# Altium project SHMP_MainBoard.PrjPcb
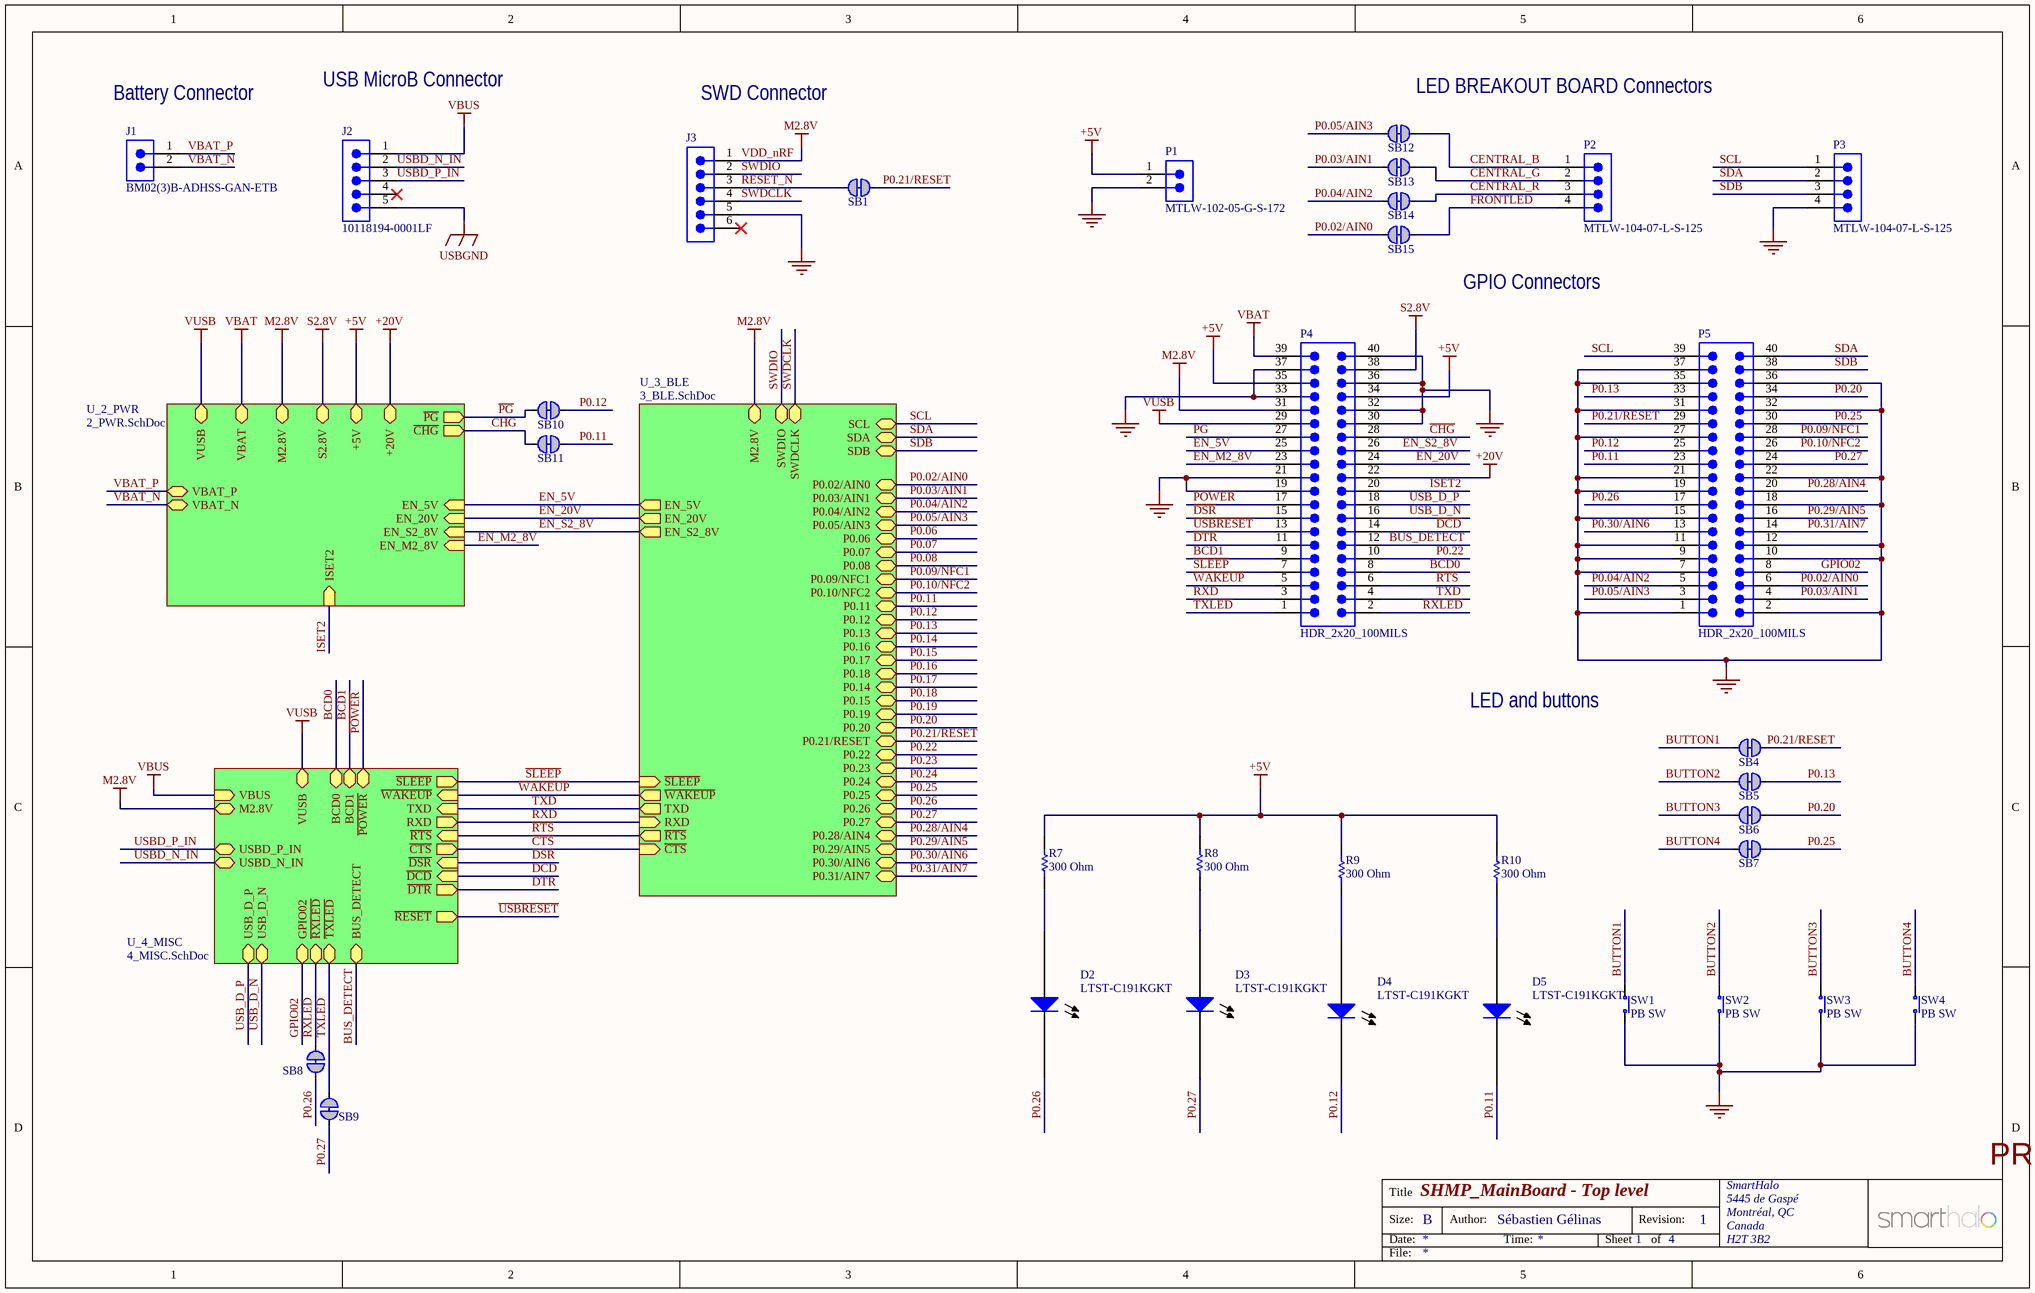
[diagram p0: 1_TOP.SchDoc]
ApprovedBy: Olivier Bourbonnais
4 sheets, 115 parts. Net scope: hierarchical (ports join the sheet entries above them; power ports are global).
Board file: SHMP_MainBoard.PcbDoc
Sheets:
  1_TOP.SchDoc
    U_3_BLE = 3_BLE.SchDoc
    U_2_PWR = 2_PWR.SchDoc
    U_4_MISC = 4_MISC.SchDoc

## Sheet 1_TOP.SchDoc: SHMP_MainBoard - Top level
size B; Author: Sébastien Gélinas; Organization: SmartHalo; Address1: 5445 de Gaspé; Address2: Montréal, QC; Address3: Canada; Address4: H2T 3B2; DocumentNumber: 1; Revision: 1; SheetNumber: 1; SheetTotal: 4

### Parts
D2  LTST-C191KGKT  [LTST-C191KGKT]
D3  LTST-C191KGKT  [LTST-C191KGKT]
D4  LTST-C191KGKT  [LTST-C191KGKT]
D5  LTST-C191KGKT  [LTST-C191KGKT]
J1  BM02(3)B-ADHSS-GAN-ETB  [BM02(3)B-ADHSS-GAN-ETB]
J2  10118194-0001LF  [10118194-0001LF]
J3  (no value)  [JLINK_6PIN_NEEDLE_ADAPTER]  (no BOM)
P1  MTLW-102-05-G-S-172  [SMTC-MTLW-102-05-X-S-172]  (no BOM)
P2  MTLW-104-07-L-S-125  [SMTC-MTLW-104-07-X-S-125]  (no BOM)
P3  MTLW-104-07-L-S-125  [SMTC-MTLW-104-07-X-S-125]  (no BOM)
P4  HDR_2x20_100MILS  [HDR_2X20_100MILS]  (no BOM)
P5  HDR_2x20_100MILS  [HDR_2X20_100MILS]  (no BOM)
R7  300 Ohm  [Varitron_RES0603]
R8  300 Ohm  [Varitron_RES0603]
R9  300 Ohm  [Varitron_RES0603]
R10  300 Ohm  [Varitron_RES0603]
SB1  Solderbridge  [Solderbridge_Shorted]  (value not drawn)  (net tie, no BOM)
SB4  Solderbridge  [Solderbridge_Shorted]  (value not drawn)  (net tie, no BOM)
SB5  Solderbridge  [Solderbridge_Shorted]  (value not drawn)  (net tie, no BOM)
SB6  Solderbridge  [Solderbridge_Shorted]  (value not drawn)  (net tie, no BOM)
SB7  Solderbridge  [Solderbridge_Shorted]  (value not drawn)  (net tie, no BOM)
SB8  Solderbridge  [Solderbridge_Shorted]  (value not drawn)  (net tie, no BOM)
SB9  Solderbridge  [Solderbridge_Shorted]  (value not drawn)  (net tie, no BOM)
SB10  Solderbridge  [Solderbridge_Shorted]  (value not drawn)  (net tie, no BOM)
SB11  Solderbridge  [Solderbridge_Shorted]  (value not drawn)  (net tie, no BOM)
SB12  Solderbridge  [Solderbridge_Shorted]  (value not drawn)  (net tie, no BOM)
SB13  Solderbridge  [Solderbridge_Shorted]  (value not drawn)  (net tie, no BOM)
SB14  Solderbridge  [Solderbridge_Shorted]  (value not drawn)  (net tie, no BOM)
SB15  Solderbridge  [Solderbridge_Shorted]  (value not drawn)  (net tie, no BOM)
SW1  PB SW  [ALPS_SKHUxxx010_WO_GND]
SW2  PB SW  [ALPS_SKHUxxx010_WO_GND]
SW3  PB SW  [ALPS_SKHUxxx010_WO_GND]
SW4  PB SW  [ALPS_SKHUxxx010_WO_GND]

### Sub-sheets
U_2_PWR = 2_PWR.SchDoc: ISET2 (in), ~{PG} (out), ~{CHG} (out), EN_S2_8V (in), EN_M2_8V (in), EN_20V (in), EN_5V (in), +20V, +5V, S2.8V, M2.8V, VUSB, VBAT_N, VBAT_P, VBAT
U_3_BLE = 3_BLE.SchDoc: SDA (bidir), SDB (bidir), SCL (bidir), ~{WAKEUP} (out), ~{SLEEP} (in), RXD (in), TXD (out), P0.02/AIN0, P0.03/AIN1, P0.04/AIN2, P0.05/AIN3, P0.06, P0.07, P0.08, P0.09/NFC1, P0.10/NFC2, P0.11, P0.12, P0.13, P0.16, P0.17, P0.18, P0.14, P0.15, P0.19, P0.20, P0.21/RESET, P0.22, P0.23, P0.24, P0.25, P0.26, P0.27, P0.28/AIN4, P0.29/AIN5, P0.30/AIN6, P0.31/AIN7, SWDIO (bidir), SWDCLK (bidir), EN_S2_8V (out), EN_5V (out), EN_20V (out), ~{CTS} (in), ~{RTS} (out), M2.8V
U_4_MISC = 4_MISC.SchDoc: TXD (in), RXD (out), ~{CTS} (out), ~{RTS} (in), ~{WAKEUP} (in), ~{RESET} (out), ~{DSR} (in), ~{DCD} (in), ~{DTR} (out), BCD0, BUS_DETECT, GPIO02, ~{POWER}, ~{TXLED}, BCD1, ~{RXLED}, VBUS (in), USBD_P_IN (bidir), USBD_N_IN (bidir), USB_D_N (bidir), USB_D_P (bidir), ~{SLEEP} (out), M2.8V, VUSB

### Nets
+5V: P1.1 P4.34 P4.35 R7.2 R8.2 R9.2 R10.2 ; sheet U_2_PWR/+5V
+20V: P4.22 ; sheet U_2_PWR/+20V
GND: J1.0(ASSY) J3.5 P1.2 P3.4 P4.19 P4.21 P4.30 P4.32 P4.33 P4.36 P4.37 P4.40 P5.1 P5.2 P5.7 P5.9 P5.10 P5.11 P5.12 P5.15 P5.18 P5.19 P5.21 P5.22 P5.27 P5.31 P5.32 P5.35 P5.36 P5.37 SW1.1(N.O) SW2.1(N.O) SW3.1(N.O) SW4.1(N.O)
S2.8V: P4.38 ; sheet U_2_PWR/S2.8V
USBGND: J2.0(ASSY) J2.5
VBAT: P4.39 ; sheet U_2_PWR/VBAT
VBUS: J2.1 ; sheet U_4_MISC/VBUS
VDD_nRF: J3.1 P4.31 ; sheet U_3_BLE/M2.8V, sheet U_2_PWR/M2.8V, sheet U_4_MISC/M2.8V  [also labelled M2.8V]
VUSB: P4.29 ; sheet U_2_PWR/VUSB, sheet U_4_MISC/VUSB
BCD0: P4.8 ; sheet U_4_MISC/BCD0
BCD1: P4.9 ; sheet U_4_MISC/BCD1
BUS_DETECT: P4.12 ; sheet U_4_MISC/BUS_DETECT
BUTTON1: SB4.2 SW1.2(COM)
BUTTON2: SB5.2 SW2.2(COM)
BUTTON3: SB6.2 SW3.2(COM)
BUTTON4: SB7.2 SW4.2(COM)
~{CHG}: P4.28 SB11.1 ; sheet U_2_PWR/~{CHG}
~{CTS}: P4.10 ; sheet U_3_BLE/P0.22, sheet U_3_BLE/~{CTS}, sheet U_4_MISC/~{CTS}  [also labelled P0.22]
CENTRAL_B: P2.1 SB12.1
CENTRAL_G: P2.2 SB13.1
CENTRAL_R: P2.3 SB14.1
~{DCD}: P4.14 ; sheet U_4_MISC/~{DCD}
~{DSR}: P4.15 ; sheet U_4_MISC/~{DSR}
~{DTR}: P4.11 ; sheet U_4_MISC/~{DTR}
EN_5V: P4.25 ; sheet U_3_BLE/P0.14, sheet U_3_BLE/EN_5V, sheet U_2_PWR/EN_5V  [also labelled P0.17]
EN_20V: P4.24 ; sheet U_3_BLE/P0.15, sheet U_3_BLE/EN_20V, sheet U_2_PWR/EN_20V  [also labelled P0.18]
EN_M2_8V: P4.23 ; sheet U_2_PWR/EN_M2_8V
EN_S2_8V: P4.26 ; sheet U_3_BLE/P0.16, sheet U_3_BLE/EN_S2_8V, sheet U_2_PWR/EN_S2_8V  [also labelled P0.14]
FRONTLED: P2.4 SB15.1
GPIO02: P5.8 ; sheet U_4_MISC/GPIO02
ISET2: P4.20 ; sheet U_2_PWR/ISET2
P0.02/AIN0: P5.6 SB15.2 ; sheet U_3_BLE/P0.02/AIN0
P0.03/AIN1: P5.4 SB13.2 ; sheet U_3_BLE/P0.03/AIN1
P0.04/AIN2: P5.5 SB14.2 ; sheet U_3_BLE/P0.04/AIN2
P0.05/AIN3: P5.3 SB12.2 ; sheet U_3_BLE/P0.05/AIN3
P0.06: P4.7 ; sheet U_3_BLE/~{SLEEP}, sheet U_3_BLE/P0.06, sheet U_4_MISC/~{SLEEP}  [also labelled ~{SLEEP}]
P0.07: P4.5 ; sheet U_3_BLE/~{WAKEUP}, sheet U_3_BLE/P0.07, sheet U_4_MISC/~{WAKEUP}  [also labelled ~{WAKEUP}]
P0.08: P4.6 ; sheet U_3_BLE/P0.08, sheet U_3_BLE/~{RTS}, sheet U_4_MISC/~{RTS}  [also labelled ~{RTS}]
P0.09/NFC1: P5.28 ; sheet U_3_BLE/P0.09/NFC1
P0.10/NFC2: P5.26 ; sheet U_3_BLE/P0.10/NFC2
P0.11: D5.2(Cathode) P5.23 SB11.2 ; sheet U_3_BLE/P0.11
P0.12: D4.2(Cathode) P5.25 SB10.2 ; sheet U_3_BLE/P0.12
P0.13: P5.33 SB5.1 ; sheet U_3_BLE/P0.13
P0.15: P3.1 P5.39 ; sheet U_3_BLE/SCL, sheet U_3_BLE/P0.17  [also labelled SCL]
P0.16: P3.2 P5.40 ; sheet U_3_BLE/SDA, sheet U_3_BLE/P0.18  [also labelled SDA]
P0.19: P3.3 P5.38 ; sheet U_3_BLE/SDB, sheet U_3_BLE/P0.19  [also labelled SDB]
P0.20: P5.34 SB6.1 ; sheet U_3_BLE/P0.20
P0.21/RESET: P5.29 SB1.1 SB4.1 ; sheet U_3_BLE/P0.21/RESET
P0.23: P4.4 ; sheet U_3_BLE/TXD, sheet U_3_BLE/P0.23, sheet U_4_MISC/TXD  [also labelled TXD]
P0.24: P4.3 ; sheet U_3_BLE/RXD, sheet U_3_BLE/P0.24, sheet U_4_MISC/RXD  [also labelled RXD]
P0.25: P5.30 SB7.1 ; sheet U_3_BLE/P0.25
P0.26: D2.2(Cathode) P5.17 SB8.2 ; sheet U_3_BLE/P0.26
P0.27: D3.2(Cathode) P5.24 SB9.2 ; sheet U_3_BLE/P0.27
P0.28/AIN4: P5.20 ; sheet U_3_BLE/P0.28/AIN4
P0.29/AIN5: P5.16 ; sheet U_3_BLE/P0.29/AIN5
P0.30/AIN6: P5.13 ; sheet U_3_BLE/P0.30/AIN6
P0.31/AIN7: P5.14 ; sheet U_3_BLE/P0.31/AIN7
~{PG}: P4.27 SB10.1 ; sheet U_2_PWR/~{PG}
~{POWER}: P4.17 ; sheet U_4_MISC/~{POWER}
~{RXLED}: P4.2 SB8.1 ; sheet U_4_MISC/~{RXLED}
RESET_N: J3.3 SB1.2
SWDCLK: J3.4 ; sheet U_3_BLE/SWDCLK
SWDIO: J3.2 ; sheet U_3_BLE/SWDIO
~{TXLED}: P4.1 SB9.1 ; sheet U_4_MISC/~{TXLED}
~{USBRESET}: P4.13 ; sheet U_4_MISC/~{RESET}  [project net ~{RESET}]
USB_D_N: P4.16 ; sheet U_4_MISC/USB_D_N
USB_D_P: P4.18 ; sheet U_4_MISC/USB_D_P
USBD_N_IN: J2.2 ; sheet U_4_MISC/USBD_N_IN
USBD_P_IN: J2.3 ; sheet U_4_MISC/USBD_P_IN
VBAT_N: J1.2 ; sheet U_2_PWR/VBAT_N
VBAT_P: J1.1 ; sheet U_2_PWR/VBAT_P
NetD2_1: D2.1(Anode) R7.1
NetD3_1: D3.1(Anode) R8.1
NetD4_1: D4.1(Anode) R9.1
NetD5_1: D5.1(Anode) R10.1

Not connected (* = marked no-connect by the designer): J2 4*; J3 6*

### Notes on the sheet
- (near J1) Battery Connector
- USB MicroB Connector
- SWD Connector
- (near SB12) LED BREAKOUT BOARD Connectors
- GPIO Connectors
- LED and buttons
- PRELIMINARY: DO NOT USE FOR PRODUCTION
- Title
- Size:
- Date:
- B
- Author:
- Time:
- Sheet
- Revision:
- of
- File:

### Library data of the parts
D2-D5 = LTST-C191KGKT: SMT LED, Green 571nm, Discrete 2V 0603 (1608 Metric); Manufacturer: LiteOn; Manufacturer Part Number: LTST-C191KGKT; Part Number: LTST-C191KGKT; Supplier: Digikey; Footprint Name: 0603; Supplier Part Number: 160-1446-6-ND
J1 = BM02(3)B-ADHSS-GAN-ETB: Connector, 1.3 mm pitch; Manufacturer: JST; Manufacturer Part Number: BM02(3)B-ADHSS-GAN-ETB; Part Number: BM02(3)B-ADHSS-GAN-ETB; Supplier: Arrow Electronics; Footprint Name: CUSTOM(ADH Connector 2 pins)
J2 = 10118194-0001LF: Micro USB B Type Receptacle; Manufacturer: Amphenol FCI; Manufacturer Part Number: 10118194-0001LF; Part Number: 10118194-0001LF; Supplier: Arrow Electronics; Footprint Name: CUSTOM(Micro USB connector); Supplier Part Number: *
J3 = JLINK_6PIN_NEEDLE_ADAPTER: JLink 6 Pin Needle Adapter for Flasher ARM Programmer; Manufacturer: JLink; Supplier: Digikey
P1 = SMTC-MTLW-102-05-X-S-172: Low Profile .025" SQ Post Header, Through-hole, Vertical, -55 to 125 degC, 2.54 mm Pitch, 2-Pin, Male, RoHS; Manufacturer: Samtec; Pitch: 2.54 mm; ComponentLink2URL: http://www.samtec.com/documents/webfiles/pdf/MTLW_TH.PDF; PackageDescription: Low Profile Terminal Assembly; ComponentLink3URL: http://www.samtec.com/documents/webfiles/cpdf/MTLW-1XX-XX-XX-X-XXX-XX-XX-MKT1.pdf; PackageReference: MTLW-102-05-X-S-172; Mounting Technology: Through-hole; ComponentLink2Description: Datasheet; PackageVersion: T, 6/1991; Orientation: Vertical; DatasheetVersion: F-214; RoHS: True; ComponentLink3Description: Package Specification; ComponentLink1URL: http://www.samtec.com; Temperature Range: -55 to 125 degC; PartNumber: MTLW-102-05-G-S-172; ComponentLink1Description: Manufacturer URL
P2 P3 = SMTC-MTLW-104-07-X-S-125: Low Profile .025" SQ Post Header, Through-hole, Vertical, -55 to 125 degC, 2.54 mm Pitch, 4-Pin, Male, RoHS; Manufacturer: Samtec; Pitch: 2.54 mm; PackageDescription: Low Profile Terminal Assembly; PartNumber: MTLW-104-07-L-S-125; PackageReference: MTLW-104-07-X-S-125; ComponentLink1Description: Manufacturer URL; ComponentLink2Description: Datasheet; ComponentLink2URL: http://www.samtec.com/documents/webfiles/pdf/MTLW_TH.PDF; ComponentLink3Description: Package Specification; Mounting Technology: Through-hole; ComponentLink3URL: http://www.samtec.com/documents/webfiles/cpdf/MTLW-1XX-XX-XX-X-XXX-XX-XX-MKT1.pdf; ComponentLink1URL: http://www.samtec.com; Orientation: Vertical; PackageVersion: T, 6/1991; DatasheetVersion: F-214; Temperature Range: -55 to 125 degC; RoHS: True
P4 P5 = HDR_2x20_100MILS: Header, 100 mils, 2 rows, 40 pins
R7-R10 = Varitron_RES0603: 300 0.063W 5%  0603 (1608 Metric)  SMD; Case-Metric: 1608; Case-EIA: 0603; Tolerance: 5%; Technology: SMT; Power: 0.063W; Supplier: Arrow Electronics; Footprint Name: 0603; Value: 300 Ohm
SB1 SB4-SB15 = SOLDERBRIDGE_SHORTED: Shorted Solderbridge; Value: Solderbridge
SW1-SW4 = SW-PB: ALPS - SKHUALE010 - Tactile Switch, SPNO, SMD, 6.5x6.2x2.5mm; Part Number: ALPS_SKHUALE010; 2nd source part number: 688-SKHUALE010; Artikkelnr Noca: 50019001; Artikkelnr Simpro: N.A.; Manufacturer: Alps; Manufacturer Part Number: SKHUALE010; Datasheet: https://www1.elfa.se/data1/wwwroot/webroot/Z_DATA/03579000.pdf; LatestRevisionDate: 2010-02-01; Pin Count: 4; Publisher: Nordic Semiconductor; Published: 2010-02-01; Value: PB SW; Note: *; Supplier: Elfa; Supplier part number: 35-790-00; 2nd source Supplier: Mouser; Footprint Doc: ALPS_SKHUxxx010_WO_GND

## Sheet 3_BLE.SchDoc: SHMP_MainBoard - Radio
size B; Author: Sébastien Gélinas; Organization: SmartHalo; Address1: 5445 de Gaspé; Address2: Montréal, QC; Address3: Canada; Address4: H2T 3B2; DocumentNumber: 4; Revision: 1; SheetNumber: 3; SheetTotal: 4
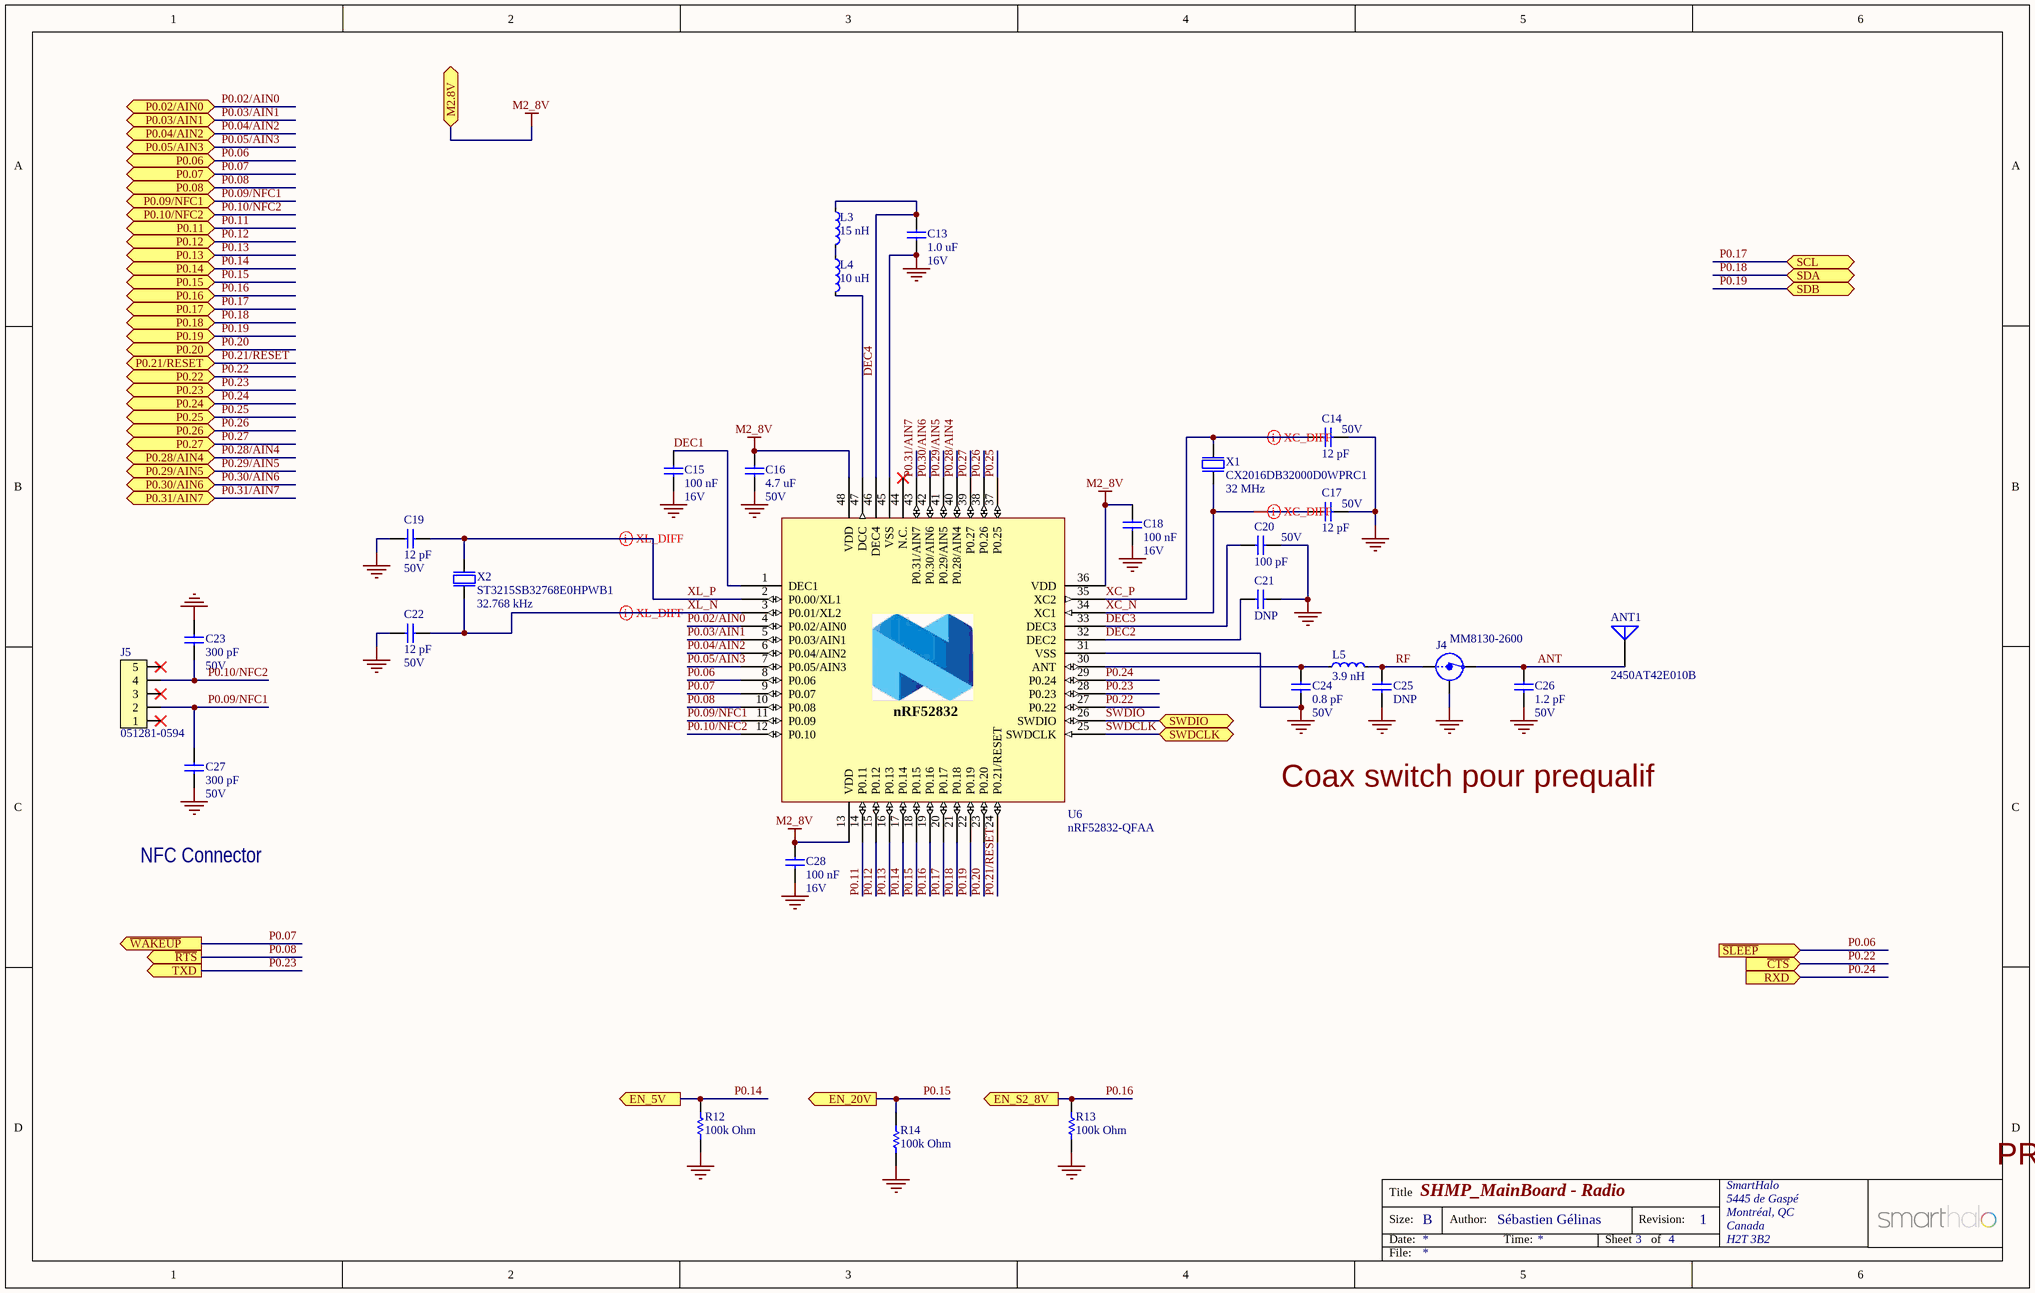
[diagram p1: 3_BLE.SchDoc]

### Parts
ANT1  2450AT42E010B  [2450AT42E010B]
C13  1.0 uF  Voltage Rating: 16V  [Varitron_CAP0603]
C14  12 pF  Voltage Rating: 50V  [Varitron_CAP0402]
C15  100 nF  Voltage Rating: 16V  [Varitron_CAP0402]
C16  4.7 uF  Voltage Rating: 50V  [Varitron_CAP0805]
C17  12 pF  Voltage Rating: 50V  [Varitron_CAP0402]
C18  100 nF  Voltage Rating: 16V  [Varitron_CAP0402]
C19  12 pF  Voltage Rating: 50V  [Varitron_CAP0402]
C20  100 pF  Voltage Rating: 50V  [Varitron_CAP0402]
C21  DNP  [Varitron_CAP0402]  (no BOM)
C22  12 pF  Voltage Rating: 50V  [Varitron_CAP0402]
C23  300 pF  Voltage Rating: 50V  [Varitron_CAP0402]
C24  0.8 pF  Voltage Rating: 50V  [Varitron_CAP0402]
C25  DNP  [Varitron_CAP0402]  (no BOM)
C26  1.2 pF  Voltage Rating: 50V  [Varitron_CAP0402]
C27  300 pF  Voltage Rating: 50V  [Varitron_CAP0402]
C28  100 nF  Voltage Rating: 16V  [Varitron_CAP0402]
J4  MM8130-2600  [COAXIAL-SWF]
J5  051281-0594  [Molex 051281-0594]
L3  15 nH  [Varitron_IND0402]
L4  10 uH  [Varitron_IND0603]
L5  3.9 nH  [Varitron_IND0402]
R12  100k Ohm  [Varitron_RES0402]
R13  100k Ohm  [Varitron_RES0402]
R14  100k Ohm  [Varitron_RES0402]
U6  nRF52832-QFAA  [QFN40P600X600X90-48N]
X1  CX2016DB32000D0WPRC1  Frequency: 32 MHz  [CRYSTAL_2016_4Pins]
X2  ST3215SB32768E0HPWB1  Frequency: 32.768 kHz  [CRYSTAL_3215_2Pins]

### Ports
EN_5V (out), EN_20V (out), EN_S2_8V (out), M2.8V, P0.02/AIN0, P0.03/AIN1, P0.04/AIN2, P0.05/AIN3, P0.06, P0.07, P0.08, P0.09/NFC1, P0.10/NFC2, P0.11, P0.12, P0.13, P0.14, P0.15, P0.16, P0.17, P0.18, P0.19, P0.20, P0.21/RESET, P0.22, P0.23, P0.24, P0.25, P0.26, P0.27, P0.28/AIN4, P0.29/AIN5, P0.30/AIN6, P0.31/AIN7, RXD (in), SCL (bidir), SDA (bidir), SDB (bidir), SWDCLK (bidir), SWDIO (bidir), TXD (out), ~{CTS} (in), ~{RTS} (out), ~{SLEEP} (in), ~{WAKEUP} (out)

### Nets
GND: ANT1.3(GND) ANT1.4(GND) C13.2 C14.2 C15.2 C16.2 C17.2 C18.2 C19.1 C20.2 C21.2 C22.1 C23.2 C24.1 C25.1 C26.1 C27.2 C28.2 J4.2(Shield) R12.1 R13.1 R14.2 U6.31(VSS) U6.45(VSS) U6.49(GND) X1.2(GND) X1.4(GND)
M2_8V: C16.1 C18.1 C28.1 U6.13(VDD) U6.36(VDD) U6.48(VDD) ; port M2.8V  [project net VDD_nRF]
ANT: ANT1.1(Feed) C26.2 J4.3(OUT)
DEC1: C15.1 U6.1(DEC1)
DEC2: C21.1 U6.32(DEC2)
DEC3: C20.1 U6.33(DEC3)
DEC4: C13.1 L3.1 U6.46(DEC4)
P0.02/AIN0: U6.4(P0.02/AIN0) ; port P0.02/AIN0
P0.03/AIN1: U6.5(P0.03/AIN1) ; port P0.03/AIN1
P0.04/AIN2: U6.6(P0.04/AIN2) ; port P0.04/AIN2
P0.05/AIN3: U6.7(P0.05/AIN3) ; port P0.05/AIN3
P0.06: U6.8(P0.06) ; port ~{SLEEP}, port P0.06
P0.07: U6.9(P0.07) ; port ~{WAKEUP}, port P0.07
P0.08: U6.10(P0.08) ; port ~{RTS}, port P0.08
P0.09/NFC1: C27.1 J5.2 U6.11(P0.09) ; port P0.09/NFC1
P0.10/NFC2: C23.1 J5.4 U6.12(P0.10) ; port P0.10/NFC2
P0.11: U6.14(P0.11) ; port P0.11
P0.12: U6.15(P0.12) ; port P0.12
P0.13: U6.16(P0.13) ; port P0.13
P0.14: R12.2 U6.17(P0.14) ; port EN_5V, port P0.14  [project net EN_5V]
P0.15: R14.1 U6.18(P0.15) ; port EN_20V, port P0.15  [project net EN_20V]
P0.16: R13.2 U6.19(P0.16) ; port EN_S2_8V, port P0.16  [project net EN_S2_8V]
P0.17: U6.20(P0.17) ; port SCL, port P0.17  [project net P0.15]
P0.18: U6.21(P0.18) ; port SDA, port P0.18  [project net P0.16]
P0.19: U6.22(P0.19) ; port SDB, port P0.19
P0.20: U6.23(P0.20) ; port P0.20
P0.21/RESET: U6.24(P0.21/RESET) ; port P0.21/RESET
P0.22: U6.27(P0.22) ; port ~{CTS}, port P0.22  [project net ~{CTS}]
P0.23: U6.28(P0.23) ; port TXD, port P0.23
P0.24: U6.29(P0.24) ; port RXD, port P0.24
P0.25: U6.37(P0.25) ; port P0.25
P0.26: U6.38(P0.26) ; port P0.26
P0.27: U6.39(P0.27) ; port P0.27
P0.28/AIN4: U6.40(P0.28/AIN4) ; port P0.28/AIN4
P0.29/AIN5: U6.41(P0.29/AIN5) ; port P0.29/AIN5
P0.30/AIN6: U6.42(P0.30/AIN6) ; port P0.30/AIN6
P0.31/AIN7: U6.43(P0.31/AIN7) ; port P0.31/AIN7
RF: C25.2 J4.1(IN) L5.2
SWDCLK: U6.25(SWDCLK) ; port SWDCLK
SWDIO: U6.26(SWDIO) ; port SWDIO
XC_N: C17.1 U6.34(XC1) X1.3(out)
XC_P: C14.1 U6.35(XC2) X1.1(inp)
XL_N: C22.2 U6.3(P0.01/XL2) X2.2
XL_P: C19.2 U6.2(P0.00/XL1) X2.1
NetC24_2: C24.2 L5.1 U6.30(ANT)
NetL3_2: L3.2 L4.1
NetL4_2: L4.2 U6.47(DCC)

Not connected (* = marked no-connect by the designer): ANT1 2(NC); J5 1* 3* 5*; U6 44(N.C.)*

### Layout directives
differential pair: XC_N, XC_P, XL_N, XL_P

### Notes on the sheet
- Coax switch pour prequalif
- NFC Connector
- PRELIMINARY: DO NOT USE FOR PRODUCTION
- Title
- Size:
- Date:
- B
- Author:
- Time:
- Sheet
- Revision:
- of
- File:
- (in symbol nRF52832_QFAA) nRF52832

### Library data of the parts
ANT1 = 2450AT42E010B: CHIP ANTENNA, 2.45GHz, 5 x 2 x 1.5 mm body; Manufacturer: Johanson Technology; Part Number: 2450AT42E010B; Manufacturer Part Number: 2450AT42E010B; Supplier: Arrow Electronics; Footprint Name: CUSTOM(2 pins)
C13 = Varitron_CAP0603: 1.0 uF 16V X7R 10% 0603 (1608 Metric)  SMD; Case-EIA: 0603; Case-Metric: 1608; Tolerance: 10%; Technology: SMT; Temperature Coefficient: X7R; Value: 1.0 uF; Supplier: Arrow Electronics; Footprint Name: 0603
C14 C17 C19 C22 = Varitron_CAP0402: 12 pF 50V NP0 2% 0402 (1005 Metric)  SMD; Case-EIA: 0402; Case-Metric: 1005; Tolerance: 2%; Technology: SMT; Temperature Coefficient: NP0; Value: 12 pF; Supplier: Arrow Electronics; Footprint Name: 0402
C15 C18 C28 = Varitron_CAP0402: 100 nF 16V X7R 10% 0402 (1005 Metric)  SMD; Case-EIA: 0402; Case-Metric: 1005; Tolerance: 10%; Technology: SMT; Temperature Coefficient: X7R; Value: 100 nF; Supplier: Arrow Electronics; Footprint Name: 0402
C16 = Varitron_CAP0805: 4.7 uF 50V X5R 10% 0805 (2012 Metric)  SMD; Case-EIA: 0805; Case-Metric: 2012; Tolerance: 10%; Technology: SMT; Temperature Coefficient: X5R; Value: 4.7 uF; Supplier: Arrow Electronics; Footprint Name: 0805
C20 = Varitron_CAP0402: 100 pF 50V NP0 5% 0402 (1005 Metric)  SMD; Case-EIA: 0402; Case-Metric: 1005; Tolerance: 5%; Technology: SMT; Temperature Coefficient: NP0; Value: 100 pF; Supplier: Arrow Electronics; Footprint Name: 0402
C21 C25 = Varitron_CAP0402: C nF V TEMP TOL% 0402 (1005 Metric)  SMD; Case-EIA: 0402; Case-Metric: 1005; Tolerance: TOL; Value: C nF; Technology: SMT; Supplier: Arrow Electronics; Footprint Name: 0402
C23 C27 = Varitron_CAP0402: 300 pF 50V NP0 5% 0402 (1005 Metric)  SMD; Case-EIA: 0402; Case-Metric: 1005; Tolerance: 5%; Technology: SMT; Temperature Coefficient: NP0; Value: 300 pF; Supplier: Arrow Electronics; Footprint Name: 0402
C24 = Varitron_CAP0402: 0.8 pF 50V NP0 5% 0402 (1005 Metric)  SMD; Case-EIA: 0402; Case-Metric: 1005; Tolerance: 5%; Technology: SMT; Temperature Coefficient: NP0; Value: 0.8 pF; Supplier: Arrow Electronics; Footprint Name: 0402
C26 = Varitron_CAP0402: 1.2 pF 50V NP0 ±0.1 pF 0402 (1005 Metric)  SMD; Case-EIA: 0402; Case-Metric: 1005; Tolerance: ±0.1 pF; Technology: SMT; Temperature Coefficient: NP0; Value: 1.2 pF; Supplier: Arrow Electronics; Footprint Name: 0402
J4 = Coaxial-Internal-SW: Coaxial Connector with Switch; Manufacturer: Murata; 2nd source part number: 81-MM8130-2600RA2; Artikkelnr Noca: 55029011; Artikkelnr Simpro: N.A.; Part Number: MM8130-2600; Manufacturer Part Number: MM8130-2600; Datasheet: http://www.murata.com/products/catalog/pdf/o33e.pdf; LatestRevisionDate: 2014-04-24; Pin Count: 3; Publisher: Nordic Semiconductor; Published: 2014-04-24; Note: *; Supplier: Digi-Key; Supplier part number: 490-4981-1-ND; 2nd source Supplier: Mouser; Footprint Doc: COAXIAL-SWF; Footprint Name: CUSTOM(6 pins)
J5 = Molex 051281-0594: CONN FFC FPC 5POS 0.50MM R/A; Manufacturer: Molex; Artikkelnr Noca: N.A.; Part Number: Molex 051281-0594; Manufacturer Part Number: 051281-0594; Datasheet: http://www.molex.com/pdm_docs/sd/512810694_sd.pdf; Footprint Doc: Molex 051281-0594; LatestRevisionDate: 2015-06-22; Pin Count: 7; Publisher: Nordic Semiconductor; Published: 2015-06-22; Value: Molex 051281-0594; Note: *; Supplier: Digi-Key; Supplier part number: WM9836CT-ND; 2nd source Supplier: *; 2nd source part number: *; Artikkelnr Simpro: N.A.; Footprint Name: CUSTOM(5 pins)
L3 = Varitron_IND0402: 15 nH 5%, 320 mA, 0402 (1005 Metric)  SMD; Manufacturer: Taiyo Yuden; Manufacturer Part Number: HK100515NJ-T; Case-EIA: 0402; Case-Metric: 1005; SRF: MHz; DCR: Ohm; Tolerance: 5%; Technology: SMT; Part Number: HK100515NJ-T; Value: 15 nH; Supplier: Arrow Electronics; Footprint Name: 0402
L4 = Varitron_IND0603: 10 uH 10%, 80 mA, 0603 (1608 Metric)  SMD; Manufacturer: Taiyo Yuden; Manufacturer Part Number: LBMF1608T100K; Case-EIA: 0603; Case-Metric: 1608; SRF: MHz; DCR: Ohm; Tolerance: 10%; Technology: SMT; Part Number: LBMF1608T100K; Value: 10 uH; Supplier: Arrow Electronics; Footprint Name: 0603
L5 = Varitron_IND0402: 3.9 nH ±0.1 nH 0402 (1005 Metric)  SMD; Manufacturer: Murata; Manufacturer Part Number: LQP15MN3N9B02D; Case-EIA: 0402; Case-Metric: 1005; Tolerance: ±0.1 nH; SRF: MHz; DCR: Ohm; Technology: SMT; Part Number: LQP15MN3N9B02D; Value: 3.9 nH; Supplier: Arrow Electronics; Footprint Name: 0402
R12-R14 = Varitron_RES0402: 100k 0.063W 5%  0402 (1005 Metric)  SMD; Case-Metric: 1005; Case-EIA: 0402; Tolerance: 5%; Technology: SMT; Power: 0.063W; Value: 100k Ohm; Supplier: Arrow Electronics; Footprint Name: 0402
U6 = nRF52832_QFAA: Multi-protocol Bluetooth Low Energy and 2.4GHz proprietary system-on-chip; Manufacturer: Nordic Semiconductor; Artikkelnr Noca: N.A.; Part Number: nRF52832-QFAA; Manufacturer Part Number: nRF52832-QFAA; Datasheet: *; LatestRevisionDate: 2014-11-26; Pin Count: 48; Publisher: Nordic Semiconductor; Published: 2014-11-26; Note: *; Supplier: Arrow Electronics; Supplier part number: *; 2nd source Supplier: *; 2nd source part number: *; Footprint Doc: QFN-48; Artikkelnr Simpro: N.A.; Footprint Name: QFN48TP
X1 = CX2016DB32000D0WPRC1: XTAL 32 MHz, 8pF, 3.2 x 1.5 mm, ±20 ppm Tol, ±200 ppm Drift; Manufacturer: AVX/Kyocera; Frequency Drift: ±40 ppm; Manufacturer Part Number: CX2016DB32000D0WPRC1; Part Number: CX2016DB32000D0WPRC1; Frequency Tolerance: ±40 ppm; Load Capacitance: 8 pF; Supplier: Arrow Electronics; Footprint Name: XTAL2016
X2 = ST3215SB32768E0HPWB1: XTAL 32.768 kHz, 9pF, 3.2 x 1.5 mm, ±20 ppm Tol, ±200 ppm Drift; Manufacturer: AVX/Kyocera; Frequency Tolerance: ±20 ppm; Frequency Drift: ±200 ppm; Manufacturer Part Number: ST3215SB32768E0HPWB1; Part Number: ST3215SB32768E0HPWB1; Load Capacitance: 9 pF; Supplier: Arrow Electronics; Footprint Name: XTAL3215

## Sheet 2_PWR.SchDoc: SHMP_MainBoard - Power Supply
size B; Author: Sébastien Gélinas; Organization: SmartHalo; Address1: 5445 de Gaspé; Address2: Montréal, QC; Address3: Canada; Address4: H2T 3B2; DocumentNumber: 1; Revision: 1; SheetNumber: 2; SheetTotal: 4
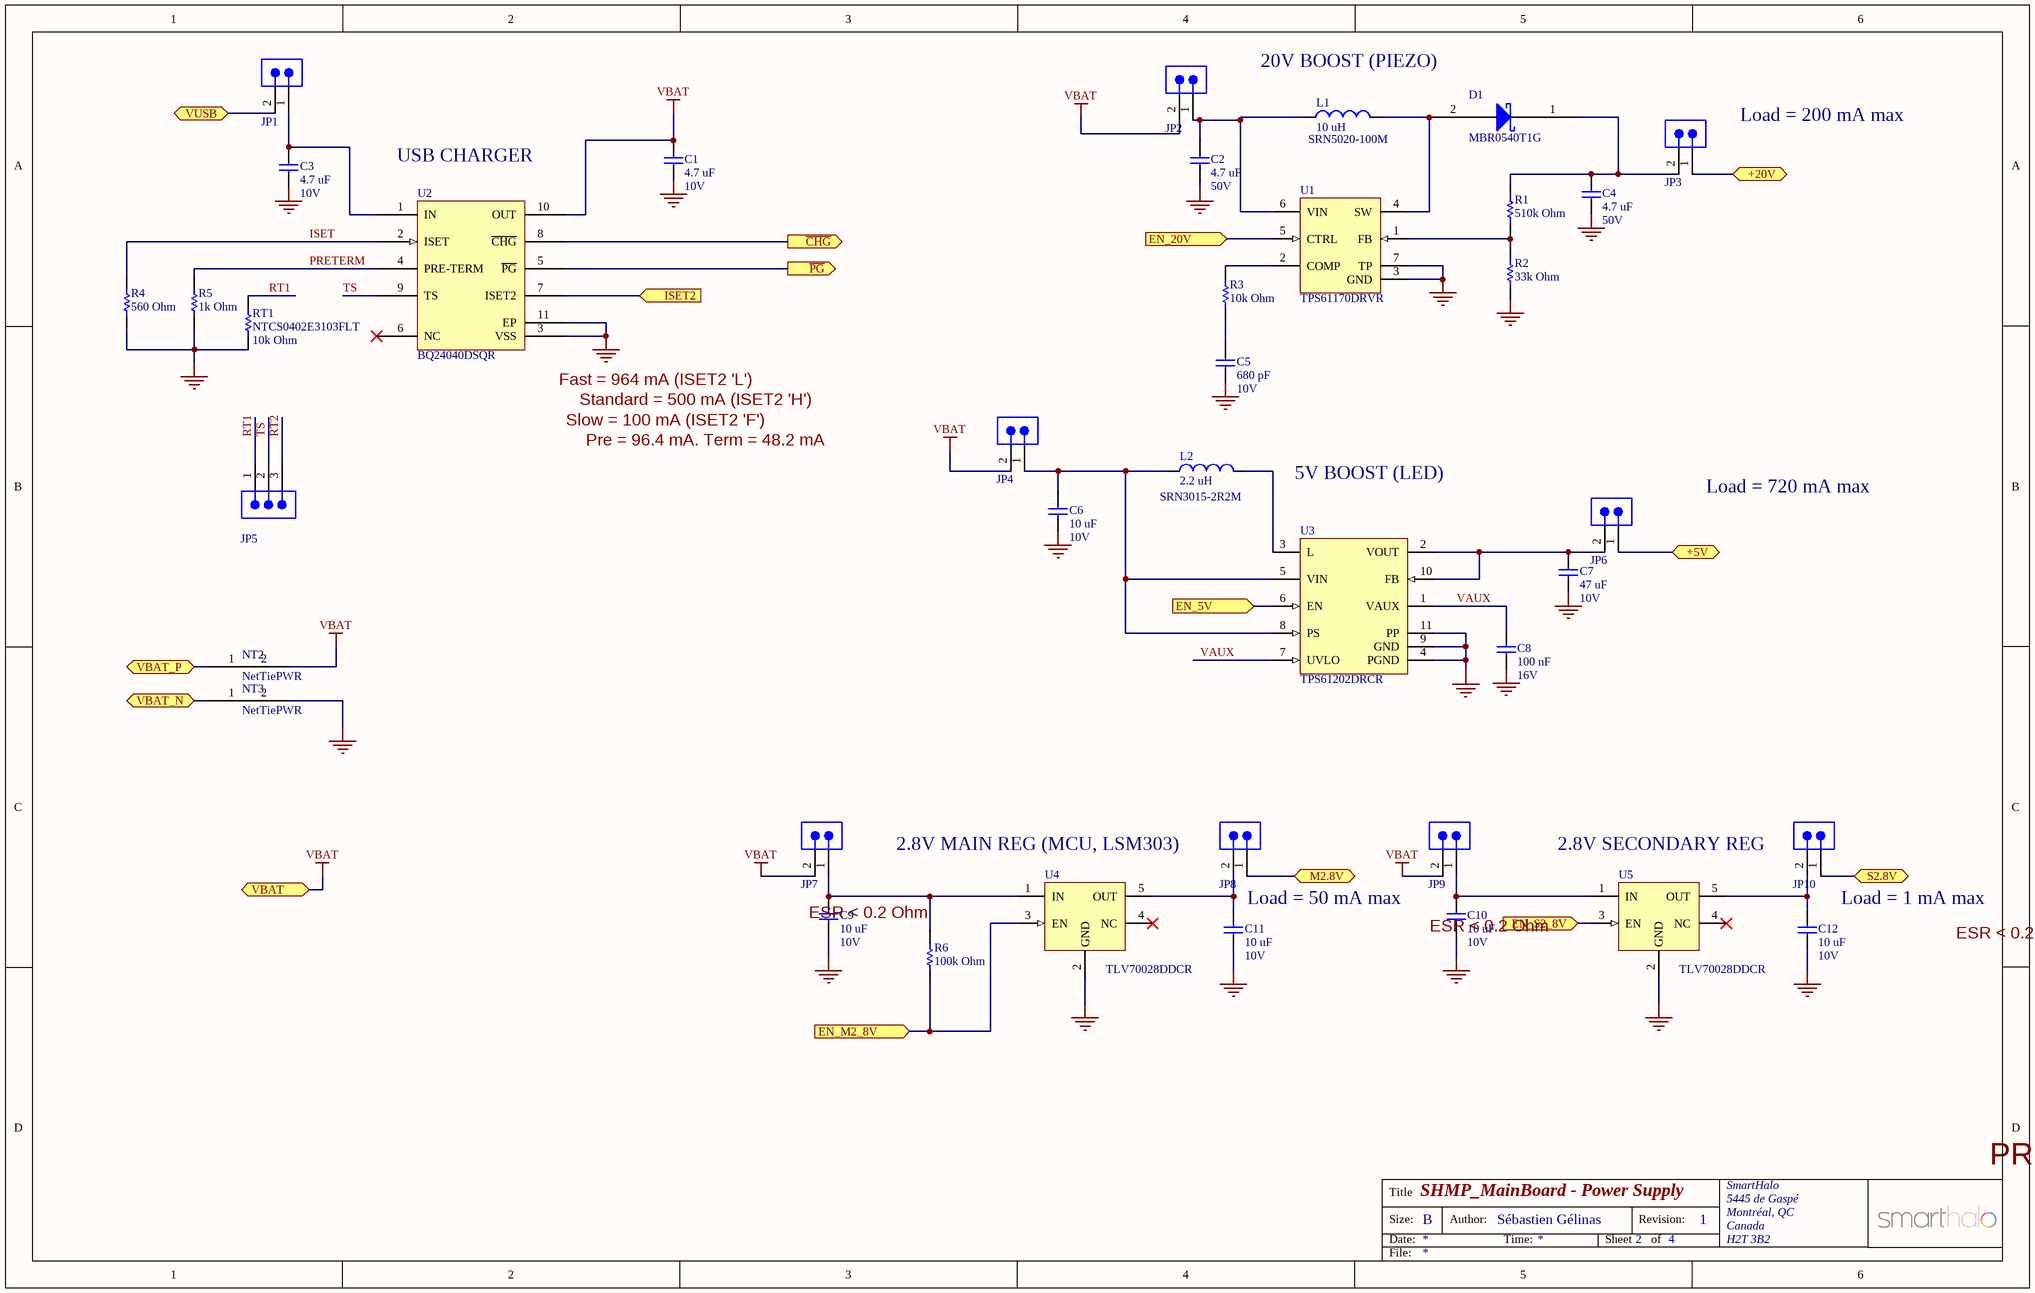
[diagram p2: 2_PWR.SchDoc]

### Parts
C1  4.7 uF  Voltage Rating: 10V  [Varitron_CAP0603]
C2  4.7 uF  Voltage Rating: 50V  [Varitron_CAP0805]
C3  4.7 uF  Voltage Rating: 10V  [Varitron_CAP0603]
C4  4.7 uF  Voltage Rating: 50V  [Varitron_CAP0805]
C5  680 pF  Voltage Rating: 10V  [Varitron_CAP0402]
C6  10 uF  Voltage Rating: 10V  [Varitron_CAP0805]
C7  47 uF  Voltage Rating: 10V  [Varitron_CAP1206]
C8  100 nF  Voltage Rating: 16V  [Varitron_CAP0402]
C9  10 uF  Voltage Rating: 10V  [Varitron_CAP0805]
C10  10 uF  Voltage Rating: 10V  [Varitron_CAP0805]
C11  10 uF  Voltage Rating: 10V  [Varitron_CAP0805]
C12  10 uF  Voltage Rating: 10V  [Varitron_CAP0805]
D1  MBR0540T1G  [ONSC-SOD-123-2-425-04_V]
JP1  JMP_2PINS_100MILS  [HDR_2X1_100MILS]  (value not drawn)  (no BOM)
JP2  JMP_2PINS_100MILS  [HDR_2X1_100MILS]  (value not drawn)  (no BOM)
JP3  JMP_2PINS_100MILS  [HDR_2X1_100MILS]  (value not drawn)  (no BOM)
JP4  JMP_2PINS_100MILS  [HDR_2X1_100MILS]  (value not drawn)  (no BOM)
JP5  JMP_3PINS_100MILS  [HDR_1X3_100MILS]  (value not drawn)  (no BOM)
JP6  JMP_2PINS_100MILS  [HDR_2X1_100MILS]  (value not drawn)  (no BOM)
JP7  JMP_2PINS_100MILS  [HDR_2X1_100MILS]  (value not drawn)  (no BOM)
JP8  JMP_2PINS_100MILS  [HDR_2X1_100MILS]  (value not drawn)  (no BOM)
JP9  JMP_2PINS_100MILS  [HDR_2X1_100MILS]  (value not drawn)  (no BOM)
JP10  JMP_2PINS_100MILS  [HDR_2X1_100MILS]  (value not drawn)  (no BOM)
L1  10 uH  [SRN5020-100M]
L2  2.2 uH  [SRN3015-2R2M]
NT2  NetTiePWR  [NetTiePWR]  (net tie, no BOM)
NT3  NetTiePWR  [NetTiePWR]  (net tie, no BOM)
R1  510k Ohm  [Varitron_RES0402]
R2  33k Ohm  [Varitron_RES0402]
R3  10k Ohm  [Varitron_RES0402]
R4  560 Ohm  [Varitron_RES0402]
R5  1k Ohm  [Varitron_RES0402]
R6  100k Ohm  [Varitron_RES0402]
RT1  NTCS0402E3103FLT  value 10k Ohm  [Varitron_RES0402]
U1  TPS61170DRVR  [DRV6-1600X1000TP]
U2  BQ24040DSQR  [DSQ10-1500X900TP]
U3  TPS61202DRCR  [DRC10-2400X1650TP]
U4  TLV70028DDCR  [SOT23-5_N]
U5  TLV70028DDCR  [SOT23-5_N]

### Ports
+5V, +20V, EN_5V (in), EN_20V (in), EN_M2_8V (in), EN_S2_8V (in), ISET2 (in), M2.8V, S2.8V, VBAT, VBAT_N, VBAT_P, VUSB, ~{CHG} (out), ~{PG} (out)

### Nets
+5V: JP6.1 ; port +5V
+20V: JP3.1 ; port +20V
GND: C1.2 C2.2 C3.2 C4.2 C5.2 C6.2 C7.2 C8.2 C9.2 C10.2 C11.2 C12.2 NT3.2(NET2) R2.1 R4.2 R5.2 RT1.1 U1.3(GND) U1.7(TP) U2.3(VSS) U2.11(EP) U3.4(PGND) U3.9(GND) U3.11(PP) U4.2(GND) U5.2(GND)
S2.8V: JP10.1 ; port S2.8V
VBAT: C1.1 JP2.2 JP4.2 JP7.2 JP9.2 NT2.2(NET2) U2.10(OUT) ; port VBAT
VDD_nRF: JP8.1 ; port M2.8V
VUSB: JP1.2 ; port VUSB
~{CHG}: U2.8(~{CHG}) ; port ~{CHG}
EN_5V: U3.6(EN) ; port EN_5V
EN_20V: U1.5(CTRL) ; port EN_20V
EN_M2_8V: R6.1 U4.3(EN) ; port EN_M2_8V
EN_S2_8V: U5.3(EN) ; port EN_S2_8V
ISET: R4.1 U2.2(ISET)
ISET2: U2.7(ISET2) ; port ISET2
~{PG}: U2.5(~{PG}) ; port ~{PG}
PRETERM: R5.1 U2.4(PRE-TERM)
RT1: JP5.1 RT1.2
RT2: JP5.3
TS: JP5.2 U2.9(TS)
VAUX: C8.1 U3.1(VAUX) U3.7(UVLO)
VBAT_N: NT3.1(NET1) ; port VBAT_N
VBAT_P: NT2.1(NET1) ; port VBAT_P
NetC2_1: C2.1 JP2.1 L1.1 U1.6(VIN)
NetC3_1: C3.1 JP1.1 U2.1(IN)
NetC4_1: C4.1 D1.1(Cathode) JP3.2 R1.2
NetC5_1: C5.1 R3.2
NetC6_1: C6.1 JP4.1 L2.1 U3.5(VIN) U3.8(PS)
NetC7_1: C7.1 JP6.2 U3.2(VOUT) U3.10(FB)
NetC9_1: C9.1 JP7.1 R6.2 U4.1(IN)
NetC10_1: C10.1 JP9.1 U5.1(IN)
NetC11_1: C11.1 JP8.2 U4.5(OUT)
NetC12_1: C12.1 JP10.2 U5.5(OUT)
NetD1_2: D1.2(Anode) L1.2 U1.4(SW)
NetL2_2: L2.2 U3.3(L)
NetR1_1: R1.1 R2.2 U1.1(FB)
NetR3_1: R3.1 U1.2(COMP)

Not connected (* = marked no-connect by the designer): U2 6(NC)*; U4 4(NC)*; U5 4(NC)*

### Notes on the sheet
- 20V BOOST (PIEZO)
- (near U2) USB CHARGER
- (near JP3) Load = 200 mA max
- (near U2) Fast = 964 mA (ISET2 'L')
- Slow = 100 mA (ISET2 'F')
- Standard = 500 mA (ISET2 'H')
- Pre = 96.4 mA. Term = 48.2 mA
- 5V BOOST (LED)
- Load = 720 mA max
- (near U4) 2.8V MAIN REG (MCU, LSM303)
- (near C11) Load = 50 mA max
- (near U5) 2.8V SECONDARY REG
- Load = 1 mA max
- (near C9) ESR < 0.2 Ohm
- (near C10) ESR < 0.2 Ohm
- (near C12) ESR < 0.2 Ohm
- PRELIMINARY: DO NOT USE FOR PRODUCTION
- Title
- Size:
- Date:
- B
- Author:
- Time:
- Sheet
- Revision:
- of
- File:

### Library data of the parts
C1 C3 = Varitron_CAP0603: 4.7 uF 10V X7R 10% 0603 (1608 Metric)  SMD; Case-EIA: 0603; Case-Metric: 1608; Tolerance: 10%; Technology: SMT; Temperature Coefficient: X7R; Value: 4.7 uF; Supplier: Arrow Electronics; Footprint Name: 0603
C2 C4 = Varitron_CAP0805: as C16 on sheet 3_BLE; Tolerance: 10%; Technology: SMT; Temperature Coefficient: X5R; Value: 4.7 uF; Supplier: Arrow Electronics; Footprint Name: 0805
C5 = Varitron_CAP0402: 680 pF 10V X7R 10% 0402 (1005 Metric)  SMD; Case-EIA: 0402; Case-Metric: 1005; Tolerance: 10%; Technology: SMT; Temperature Coefficient: X7R; Value: 680 pF; Supplier: Arrow Electronics; Footprint Name: 0402
C6 C9-C12 = Varitron_CAP0805: 10 uF 10V X7R 10% 0805 (2012 Metric)  SMD; Case-EIA: 0805; Case-Metric: 2012; Tolerance: 10%; Technology: SMT; Temperature Coefficient: X7R; Value: 10 uF; Supplier: Arrow Electronics; Footprint Name: 0805
C7 = Varitron_CAP1206: 47 uF 10V X5R 10% 1206 (3216 Metric)  SMD; Case-EIA: 1206; Case-Metric: 3216; Tolerance: 10%; Technology: SMT; Temperature Coefficient: X5R; Value: 47 uF; Supplier: Arrow Electronics; Footprint Name: 1206
C8 = Varitron_CAP0402: as C15 on sheet 3_BLE; Tolerance: 10%; Technology: SMT; Temperature Coefficient: X7R; Value: 100 nF; Supplier: Arrow Electronics; Footprint Name: 0402
D1 = MBR0540T1G: Schottky Power Rectifier, 2-Pin SOD-123, Pb-Free, Tape and Reel; Manufacturer: ON Semiconductor; Manufacturer Part Number: MBR0540T1G; Part Number: MBR0540T1G; Supplier: Arrow Electronics; Footprint Name: SOD123
JP1-JP4 JP6-JP10 = JMP_2PINS_100MILS: Jumper, 100 mils, 2 pins
JP5 = JMP_3PINS_100MILS: Jumper, 100 mils, 3 pins
L1 = SRN5020-100M: Inductor, 10 uH, 20%, 144 mOhm DCR, 1.3A; Manufacturer: Bourns; Manufacturer Part Number: SRN5020-100M; Part Number: SRN5020-100M; Value: 10 uH; Tolerance: 20%; DCR: 144 mOhm; Saturation Current: 1.3A; Supplier: Arrow Electronics; Footprint Name: IND5020
L2 = SRN3015-2R2M: Inductor, 2.2 uH, 20%, 72 mOhm DCR, 1.65A; Manufacturer: Bourns; DCR: 72 mOhm; Manufacturer Part Number: SRN3015-2R2M; Part Number: SRN3015-2R2M; Value: 2.2 uH; Tolerance: 20%; Saturation Current: 1.65A; Supplier: Arrow Electronics; Footprint Name: IND3015
R1 = Varitron_RES0402: 510k 0.063W 5%  0402 (1005 Metric)  SMD; Case-Metric: 1005; Case-EIA: 0402; Tolerance: 5%; Technology: SMT; Power: 0.063W; Value: 510k Ohm; Supplier: Arrow Electronics; Footprint Name: 0402
R2 = Varitron_RES0402: 33k 0.063W 5%  0402 (1005 Metric)  SMD; Case-Metric: 1005; Case-EIA: 0402; Tolerance: 5%; Technology: SMT; Power: 0.063W; Value: 33k Ohm; Supplier: Arrow Electronics; Footprint Name: 0402
R3 = Varitron_RES0402: 10k 0.063W 5%  0402 (1005 Metric)  SMD; Case-Metric: 1005; Case-EIA: 0402; Tolerance: 5%; Technology: SMT; Power: 0.063W; Value: 10k Ohm; Supplier: Arrow Electronics; Footprint Name: 0402
R4 = Varitron_RES0402: 560R 0.063W 5%  0402 (1005 Metric)  SMD; Case-Metric: 1005; Case-EIA: 0402; Tolerance: 5%; Technology: SMT; Power: 0.063W; Value: 560 Ohm; Supplier: Arrow Electronics; Footprint Name: 0402
R5 = Varitron_RES0402: 1k 0.063W 5%  0402 (1005 Metric)  SMD; Case-Metric: 1005; Case-EIA: 0402; Tolerance: 5%; Technology: SMT; Power: 0.063W; Value: 1k Ohm; Supplier: Arrow Electronics; Footprint Name: 0402
R6 = Varitron_RES0402: as R12 on sheet 3_BLE; Tolerance: 5%; Technology: SMT; Power: 0.063W; Supplier: Arrow Electronics; Footprint Name: 0402; Value: 100k Ohm
RT1 = NTCS0402E3103FLT: Thermistor NTC 0402, R0 10k, 1%, B 3490, SMD; Manufacturer: Vishay; Case-Metric: 1005; Case-EIA: 0402; Beta: 3490; Tolerance: 1%; Technology: SMT; Part Number: NTCS0402E3103FLT; Manufacturer Part Number: NTCS0402E3103FLT; Supplier: Arrow Electronics; Footprint Name: 0402
U1 = TPS61170DRVR: Boost Voltage Converter with 3 to 18 V Input and 3 to 38 V Output, -40 to 85 degC, 6-Pin SON (DRC), Green (RoHS & no Sb/Br); Manufacturer: Texas Instruments; Part Number: TPS61170DRVR; Manufacturer Part Number: TPS61170DRVR; Supplier: Arrow Electronics; Footprint Name: SON6
U2 = BQ24040DSQR: 800 mA, Single-Input, Single Cell Li-Ion Battery Charger with Auto Start. Vovp=6.6 V, 3.5 V, -40 to 85 degC, 10-pin SON (DSQ), Green (RoHS & no Sb/Br); Manufacturer: Texas Instruments; Manufacturer Part Number: BQ24040DSQR; Part Number: BQ24040DSQR; Supplier: Arrow Electronics; Footprint Name: WSON10
U3 = TPS61202DRCR: Boost Voltage Converter with 0.3 to 5.5 V Input and 5 V Output, -40 to 85 degC, 10-Pin SON (DRC), Green (RoHS & no Sb/Br); Manufacturer: Texas Instruments; Part Number: TPS61202DRCR; Manufacturer Part Number: TPS61202DRCR; Supplier: Arrow Electronics; Footprint Name: SON10
U4 U5 = TLV70028DDCR: 200 mA Low Dropout Regulator, 2 - 5.5V Input, Fixed 2.8V Output; Manufacturer: Texas Instruments; Part Number: TLV70028DDCR; Manufacturer Part Number: TLV70028DDCR; Supplier: Arrow Electronics; Footprint Name: SOT23-5

## Sheet 4_MISC.SchDoc: SHMP_MainBoard - Misc
size B; Author: Sébastien Gélinas; Organization: SmartHalo; Address1: 5445 de Gaspé; Address2: Montréal, QC; Address3: Canada; Address4: H2T 3B2; Revision: 1; SheetNumber: 4; SheetTotal: 4
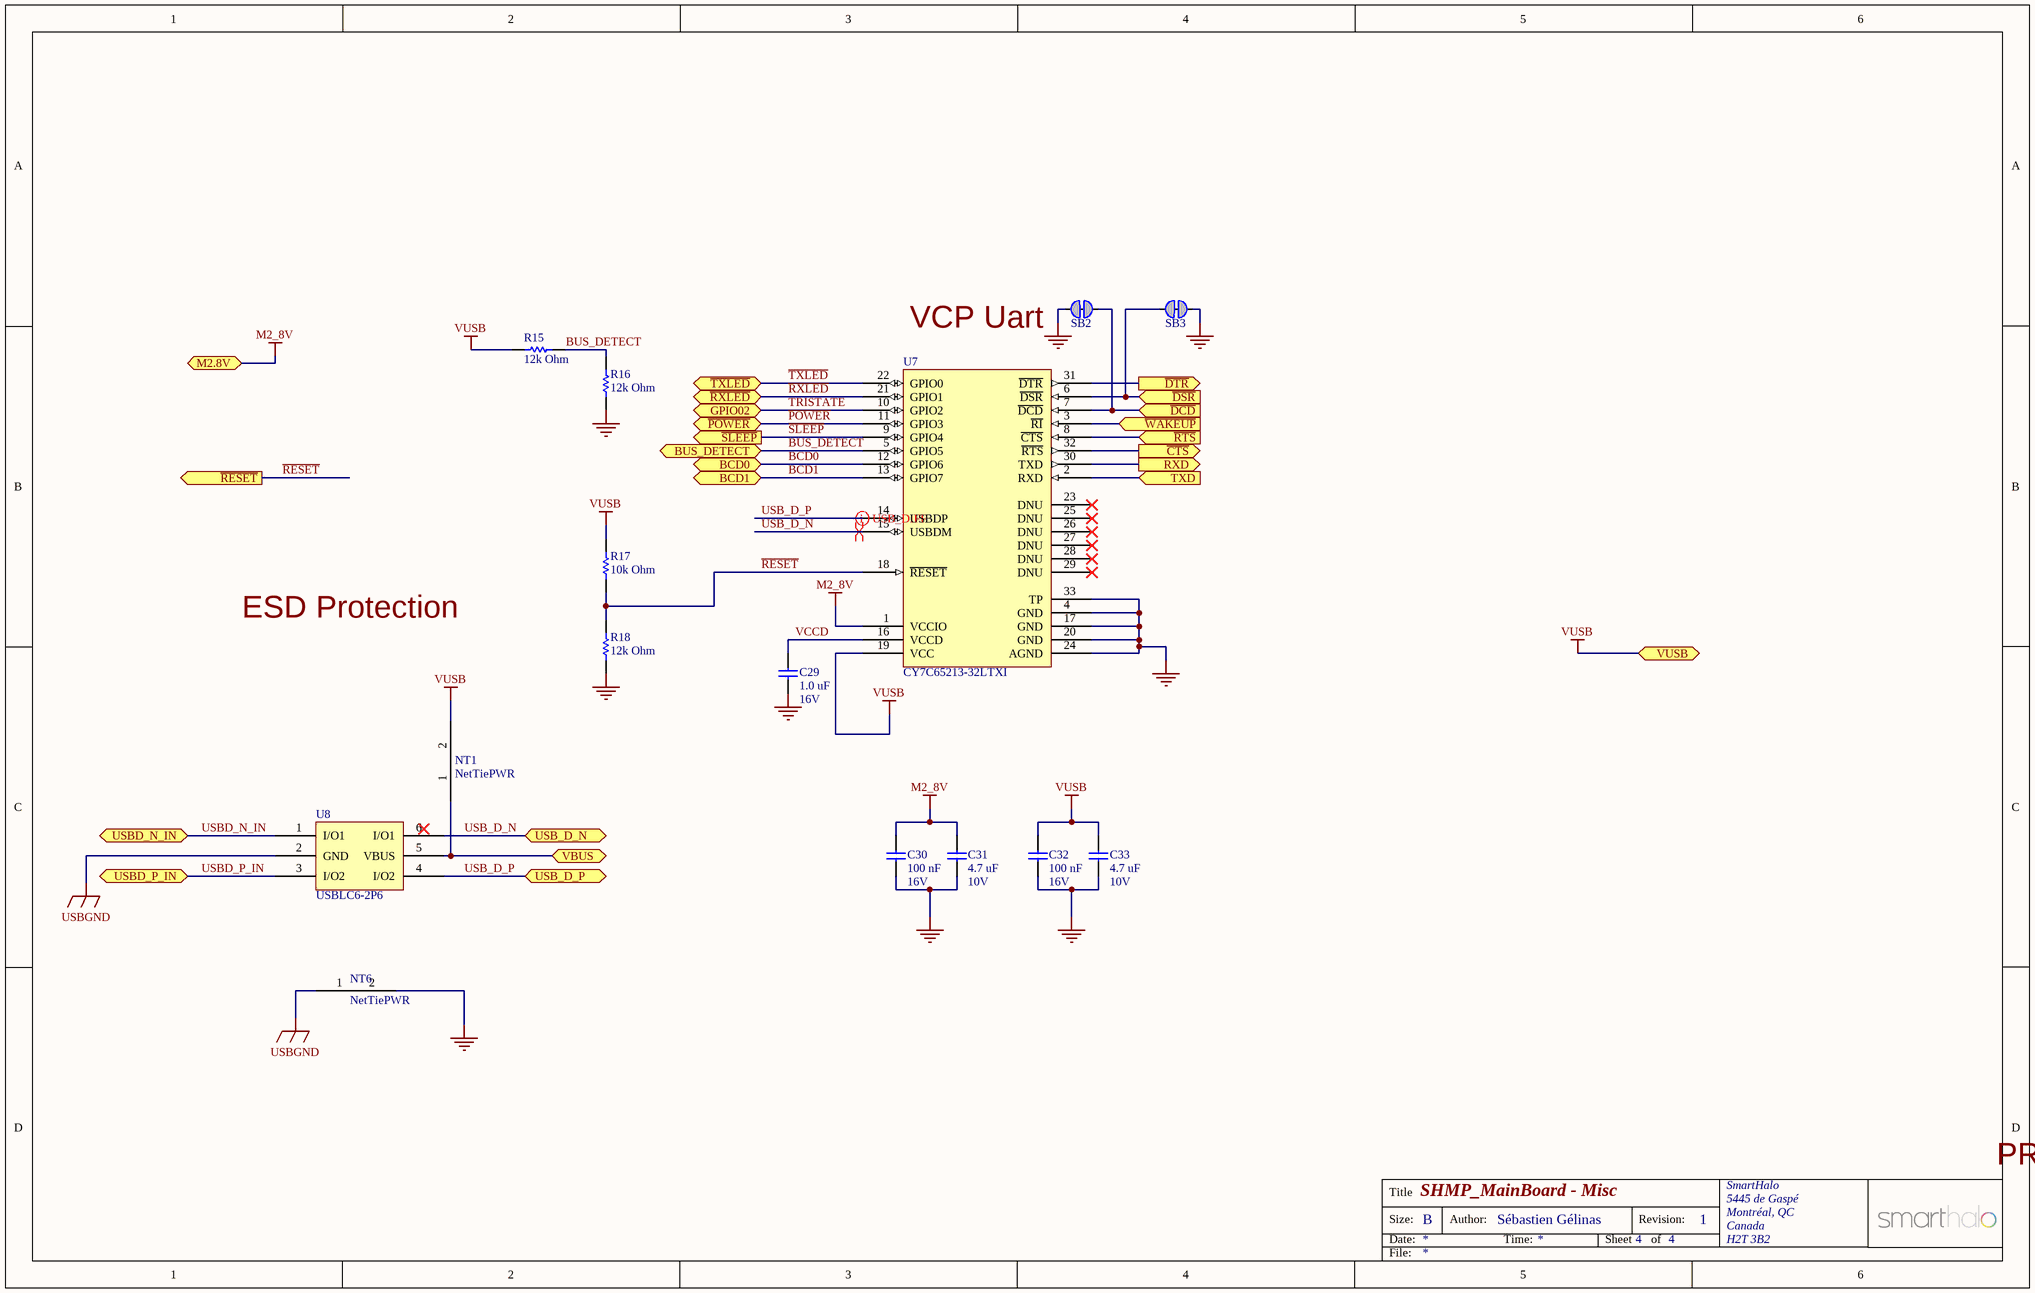
[diagram p3: 4_MISC.SchDoc]

### Parts
C29  1.0 uF  Voltage Rating: 16V  [Varitron_CAP0603]
C30  100 nF  Voltage Rating: 16V  [Varitron_CAP0402]
C31  4.7 uF  Voltage Rating: 10V  [Varitron_CAP0603]
C32  100 nF  Voltage Rating: 16V  [Varitron_CAP0402]
C33  4.7 uF  Voltage Rating: 10V  [Varitron_CAP0603]
NT1  NetTiePWR  [NetTiePWR]  (net tie, no BOM)
NT6  NetTiePWR  [NetTiePWR]  (net tie, no BOM)
R15  12k Ohm  [Varitron_RES0402]
R16  12k Ohm  [Varitron_RES0402]
R17  10k Ohm  [Varitron_RES0402]
R18  12k Ohm  [Varitron_RES0402]
SB2  Solderbridge  [Solderbridge_Shorted]  (value not drawn)  (net tie, no BOM)
SB3  Solderbridge  [Solderbridge_Shorted]  (value not drawn)  (net tie, no BOM)
U7  CY7C65213-32LTXI  [QFN-32-TP]
U8  USBLC6-2P6  [ST-SOT666]

### Ports
BCD0, BCD1, BUS_DETECT, GPIO02, M2.8V, RXD (out), TXD (in), USB_D_N (bidir), USB_D_P (bidir), USBD_N_IN (bidir), USBD_P_IN (bidir), VBUS, VUSB, ~{CTS} (out), ~{DCD} (in), ~{DSR} (in), ~{DTR} (out), ~{POWER}, ~{RESET} (out), ~{RTS} (in), ~{RXLED}, ~{SLEEP} (out), ~{TXLED}, ~{WAKEUP} (in)

### Nets
GND: C29.2 C30.2 C31.2 C32.2 C33.2 NT6.2(NET2) R16.2 R18.1 SB2.1 SB3.1 U7.4(GND) U7.17(GND) U7.20(GND) U7.24(AGND) U7.33(TP)
M2_8V: C30.1 C31.1 U7.1(VCCIO) ; port M2.8V  [project net VDD_nRF]
USBGND: NT6.1(NET1) U8.2(GND)
VBUS: NT1.1(NET1) U8.5(VBUS) ; port VBUS
VUSB: C32.1 C33.1 NT1.2(NET2) R15.2 R17.2 U7.19(VCC) ; port VUSB
BCD0: U7.12(GPIO6) ; port BCD0
BCD1: U7.13(GPIO7) ; port BCD1
BUS_DETECT: R15.1 R16.1 U7.5(GPIO5) ; port BUS_DETECT
~{CTS}: U7.32(~{RTS}) ; port ~{CTS}
~{DCD}: SB2.2 U7.7(~{DCD}) ; port ~{DCD}
~{DSR}: SB3.2 U7.6(~{DSR}) ; port ~{DSR}
~{DTR}: U7.31(~{DTR}) ; port ~{DTR}
P0.07: U7.3(~{RI}) ; port ~{WAKEUP}
P0.08: U7.8(~{CTS}) ; port ~{RTS}
P0.23: U7.2(RXD) ; port TXD
P0.24: U7.30(TXD) ; port RXD
~{POWER}: U7.11(GPIO3) ; port ~{POWER}
~{RESET}: R17.1 R18.2 U7.18(~{RESET}) ; port ~{RESET}
~{RXLED}: U7.21(GPIO1) ; port ~{RXLED}
~{SLEEP}: U7.9(GPIO4) ; port ~{SLEEP}  [project net P0.06]
~{TXLED}: U7.22(GPIO0) ; port ~{TXLED}
TRISTATE: U7.10(GPIO2) ; port GPIO02  [project net GPIO02]
USB_D_N: U7.15(USBDM) U8.6(I/O1) ; port USB_D_N
USB_D_P: U7.14(USBDP) U8.4(I/O2) ; port USB_D_P
USBD_N_IN: U8.1(I/O1) ; port USBD_N_IN
USBD_P_IN: U8.3(I/O2) ; port USBD_P_IN
VCCD: C29.1 U7.16(VCCD)

Not connected (* = marked no-connect by the designer): U7 23(DNU)* 25(DNU)* 26(DNU)* 27(DNU)* 28(DNU)* 29(DNU)*

### Layout directives
differential pair: USB_D_N, USB_D_P

### Notes on the sheet
- VCP Uart
- ESD Protection
- PRELIMINARY: DO NOT USE FOR PRODUCTION
- Title
- Size:
- Date:
- B
- Author:
- Time:
- Sheet
- Revision:
- of
- File:

### Library data of the parts
C29 = Varitron_CAP0603: as C13 on sheet 3_BLE; Tolerance: 10%; Technology: SMT; Temperature Coefficient: X7R; Value: 1.0 uF; Supplier: Arrow Electronics; Footprint Name: 0603
C30 C32 = Varitron_CAP0402: as C15 on sheet 3_BLE; Tolerance: 10%; Technology: SMT; Temperature Coefficient: X7R; Value: 100 nF; Supplier: Arrow Electronics; Footprint Name: 0402
C31 C33 = Varitron_CAP0603: as C1 on sheet 2_PWR; Tolerance: 10%; Technology: SMT; Temperature Coefficient: X7R; Value: 4.7 uF; Supplier: Arrow Electronics; Footprint Name: 0603
R15 R16 R18 = Varitron_RES0402: 12k 0.063W 5%  0402 (1005 Metric)  SMD; Case-Metric: 1005; Case-EIA: 0402; Tolerance: 5%; Technology: SMT; Power: 0.063W; Value: 12k Ohm; Supplier: Arrow Electronics; Footprint Name: 0402
R17 = Varitron_RES0402: as R3 on sheet 2_PWR; Tolerance: 5%; Technology: SMT; Power: 0.063W; Value: 10k Ohm; Supplier: Arrow Electronics; Footprint Name: 0402
SB2 SB3 = SOLDERBRIDGE_SHORTED: Shorted Solderbridge; Value: Solderbridge
U7 = CY7C65213-32LTXI: IC USB TO UART BRIDGE 32QFN; Manufacturer: Cypress; Manufacturer Part Number: CY7C65213-32LTXI; Part Number: CY7C65213-32LTXI; Supplier: Arrow Electronics; Footprint Name: QFN32TP
U8 = USBLC6-2P6: Very low capacitance ESD protection; Manufacturer: STMicroelectronics; Manufacturer Part Number: USBLC6-2P6; Part Number: USBLC6-2P6; Supplier: Arrow Electronics; Footprint Name: SOT666

## Nets that join several sheets
+5V: 1_TOP (7 pins), 2_PWR (JP6.1)
+20V: 1_TOP (P4.22), 2_PWR (JP3.1)
GND: 1_TOP (34 pins), 3_BLE (27 pins), 2_PWR (26 pins), 4_MISC (15 pins)
S2.8V: 1_TOP (P4.38), 2_PWR (JP10.1)
USBGND: 1_TOP (J2.0 J2.5), 4_MISC (NT6.1 U8.2)
VBAT: 1_TOP (P4.39), 2_PWR (7 pins)
VBUS: 1_TOP (J2.1), 4_MISC (NT1.1 U8.5)
VDD_nRF: 1_TOP (J3.1 P4.31), 3_BLE (6 pins), 2_PWR (JP8.1), 4_MISC (C30.1 C31.1 U7.1)
VUSB: 1_TOP (P4.29), 2_PWR (JP1.2), 4_MISC (6 pins)
BCD0: 1_TOP (P4.8), 4_MISC (U7.12)
BCD1: 1_TOP (P4.9), 4_MISC (U7.13)
BUS_DETECT: 1_TOP (P4.12), 4_MISC (R15.1 R16.1 U7.5)
~{CHG}: 1_TOP (P4.28 SB11.1), 2_PWR (U2.8)
~{CTS}: 1_TOP (P4.10), 3_BLE (U6.27), 4_MISC (U7.32)
~{DCD}: 1_TOP (P4.14), 4_MISC (SB2.2 U7.7)
~{DSR}: 1_TOP (P4.15), 4_MISC (SB3.2 U7.6)
~{DTR}: 1_TOP (P4.11), 4_MISC (U7.31)
EN_5V: 1_TOP (P4.25), 3_BLE (R12.2 U6.17), 2_PWR (U3.6)
EN_20V: 1_TOP (P4.24), 3_BLE (R14.1 U6.18), 2_PWR (U1.5)
EN_M2_8V: 1_TOP (P4.23), 2_PWR (R6.1 U4.3)
EN_S2_8V: 1_TOP (P4.26), 3_BLE (R13.2 U6.19), 2_PWR (U5.3)
GPIO02: 1_TOP (P5.8), 4_MISC (U7.10)
ISET2: 1_TOP (P4.20), 2_PWR (U2.7)
P0.02/AIN0: 1_TOP (P5.6 SB15.2), 3_BLE (U6.4)
P0.03/AIN1: 1_TOP (P5.4 SB13.2), 3_BLE (U6.5)
P0.04/AIN2: 1_TOP (P5.5 SB14.2), 3_BLE (U6.6)
P0.05/AIN3: 1_TOP (P5.3 SB12.2), 3_BLE (U6.7)
P0.06: 1_TOP (P4.7), 3_BLE (U6.8), 4_MISC (U7.9)
P0.07: 1_TOP (P4.5), 3_BLE (U6.9), 4_MISC (U7.3)
P0.08: 1_TOP (P4.6), 3_BLE (U6.10), 4_MISC (U7.8)
P0.09/NFC1: 1_TOP (P5.28), 3_BLE (C27.1 J5.2 U6.11)
P0.10/NFC2: 1_TOP (P5.26), 3_BLE (C23.1 J5.4 U6.12)
P0.11: 1_TOP (D5.2 P5.23 SB11.2), 3_BLE (U6.14)
P0.12: 1_TOP (D4.2 P5.25 SB10.2), 3_BLE (U6.15)
P0.13: 1_TOP (P5.33 SB5.1), 3_BLE (U6.16)
P0.15: 1_TOP (P3.1 P5.39), 3_BLE (U6.20)
P0.16: 1_TOP (P3.2 P5.40), 3_BLE (U6.21)
P0.19: 1_TOP (P3.3 P5.38), 3_BLE (U6.22)
P0.20: 1_TOP (P5.34 SB6.1), 3_BLE (U6.23)
P0.21/RESET: 1_TOP (P5.29 SB1.1 SB4.1), 3_BLE (U6.24)
P0.23: 1_TOP (P4.4), 3_BLE (U6.28), 4_MISC (U7.2)
P0.24: 1_TOP (P4.3), 3_BLE (U6.29), 4_MISC (U7.30)
P0.25: 1_TOP (P5.30 SB7.1), 3_BLE (U6.37)
P0.26: 1_TOP (D2.2 P5.17 SB8.2), 3_BLE (U6.38)
P0.27: 1_TOP (D3.2 P5.24 SB9.2), 3_BLE (U6.39)
P0.28/AIN4: 1_TOP (P5.20), 3_BLE (U6.40)
P0.29/AIN5: 1_TOP (P5.16), 3_BLE (U6.41)
P0.30/AIN6: 1_TOP (P5.13), 3_BLE (U6.42)
P0.31/AIN7: 1_TOP (P5.14), 3_BLE (U6.43)
~{PG}: 1_TOP (P4.27 SB10.1), 2_PWR (U2.5)
~{POWER}: 1_TOP (P4.17), 4_MISC (U7.11)
~{RESET}: 1_TOP (P4.13), 4_MISC (R17.1 R18.2 U7.18)
~{RXLED}: 1_TOP (P4.2 SB8.1), 4_MISC (U7.21)
SWDCLK: 1_TOP (J3.4), 3_BLE (U6.25)
SWDIO: 1_TOP (J3.2), 3_BLE (U6.26)
~{TXLED}: 1_TOP (P4.1 SB9.1), 4_MISC (U7.22)
USB_D_N: 1_TOP (P4.16), 4_MISC (U7.15 U8.6)
USB_D_P: 1_TOP (P4.18), 4_MISC (U7.14 U8.4)
USBD_N_IN: 1_TOP (J2.2), 4_MISC (U8.1)
USBD_P_IN: 1_TOP (J2.3), 4_MISC (U8.3)
VBAT_N: 1_TOP (J1.2), 2_PWR (NT3.1)
VBAT_P: 1_TOP (J1.1), 2_PWR (NT2.1)